# Altium schematic sheet LC_LPF12.SchDoc: PCB-LC_LPF12
size A4; Author: Ravi dusi; SheetNumber: 1; SheetTotal: 1
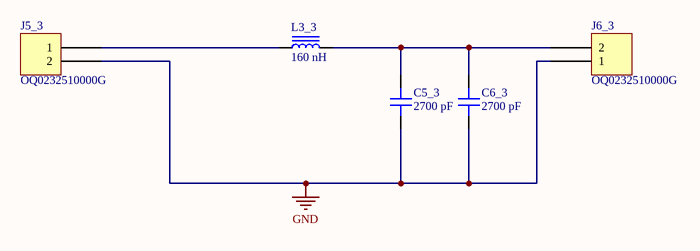
[diagram p0: LC_LPF12.SchDoc]

## Parts
C5_3  2700 pF  [CAP 0603_1608]
C6_3  2700 pF  [CAP 0603_1608]
J5_3  OQ0232510000G  [FCI 06-381-2PIN]
J6_3  OQ0232510000G  [FCI 06-381-2PIN]
L3_3  160 nH  [IND 0402_1005 RF WW]

## Nets
GND: C5_3.1 C6_3.1 J5_3.2 J6_3.1
NetC5_3_2: C5_3.2 C6_3.2 J6_3.2 L3_3.2
NetJ5_3_1: J5_3.1 L3_3.1

## Notes on the sheet
- DOCUMENT NAME:
- TITLE:
- This document is created by Mitai. Any further questions can be asked through
- AUTHOR :
- REVIEWER:
- Sheet
- PART NO.:
- of
- *
- DATE:
- TEMPLATE:
- team@mitai.ai.
- A4
- Contact Address:Rosenheimer Straße 116b,81669, München.

## Library data of the parts
C5_3 C6_3 = C0603C272F3GAC7867: CAP CER 2700PF 25V NP0 0603; manufacturer: KEMET; Temperature Coefficient: C0G, NP0; Tolerance: ±1%; Part Number: C0603C272F3GAC7867; Value: 2700 pF; Applications: General Purpose; Capacitance: 2700 pF; componentlink1description: Datasheet; componentlink1url: https://api.kemet.com/component-edge/download/datasheet/C0603C272F3GACTU.pdf; componentlink2description: DigiKey Link; componentlink2url: https://www.digikey.com/en/products/detail/kemet/C0603C272F3GAC7867/2200413; Device Package: 0603 (1608 Metric); Features: Low ESL; lastupdated: 03/09/2023 19:08:49; Lifecycle Status: Active; Minimum Order: 1; Mounting Type: Surface Mount, MLCC; Operating Temperature: -55°C ~ 125°C; Package / Case: 0603 (1608 Metric); packaging: TapeAndReel; partid: 2138; Part Status: Active; price: 0.40; series: SMD Comm C0G; Size / Dimension: 0.063" L x 0.031" W (1.60mm x 0.80mm); Supplier 1: DigiKey; Supplier Part Number 1: 399-17403-1-ND; Thickness (Max): 0.034" (0.87mm); Voltage - Rated: 25V
J5_3 J6_3 = OQ0232510000G: TERM BLOCK HDR 2POS 90DEG 3.81MM; Manufacturer: Amphenol Anytek; Current - UL: 10A; Header Orientation: 90°, Right Angle; Number of Levels: 1; Number of Positions: 2; Pitch: 0.150" (3.81mm); Voltage - UL: 300V; Part Number: OQ0232510000G; Color: Green; ComponentLink1Description: Datasheet; ComponentLink1URL: http://portal.fciconnect.com/Comergent//fci/drawing/oqxx32x100j0g.pdf; ComponentLink2Description: DigiKey Link; ComponentLink2URL: //digikey.com/product-detail/en/amphenol-anytek/OQ0232510000G/609-3819-ND/2261255; Contact Mating Finish: Tin; LastUpdated: 16/12/2019 19:14:30; Lifecycle Status: 0; Minimum Order: 1; Mounting Type: Through Hole; Operating Temperature: -40°C ~ 115°C; Packaging: Bulk; Part Status: Active; Positions Per Level: 2; Price: 0.49; Series: 06-381; Supplier 1: DigiKey; Supplier Part Number 1: 609-3819-ND; Termination Style: Solder; Type: Header, Male Pins, Shrouded (4 Side)
L3_3 = LQW15CNR16J00D: FIXED IND 160NH 480MA 330MOHM SM; Manufacturer: Murata Electronics; DC Resistance (DCR): 330mOhm Max; Frequency - Self Resonant: 900MHz; Inductance Frequency - Test: 100 MHz; Material - Core: Ferrite; Shielding: Unshielded; Tolerance: ±5%; Type: Drum Core, Wirewound; Part Number: LQW15CNR16J00D; ComponentLink1Description: Datasheet; ComponentLink1URL: https://search.murata.co.jp/Ceramy/image/img/P02/JELF243A-0087.pdf; ComponentLink2Description: DigiKey Link; ComponentLink2URL: https://www.digikey.com/en/products/detail/murata-electronics/LQW15CNR16J00D/4359664; Current Rating (Amps): 480 mA; Device Package: 0402 (1005 Metric); Height - Seated (Max): 0.024" (0.60mm); Inductance: 160 nH; LastUpdated: 03/09/2023 20:25:06; Lifecycle Status: Active; Minimum Order: 1; Mounting Type: Surface Mount; Operating Temperature: -55°C ~ 125°C; Package / Case: 0402 (1005 Metric); Packaging: TapeAndReel; PartId: 1; Part Status: Active; Price: 0.19; Series: LQW15; Size / Dimension: 0.039" L x 0.024" W (1.00mm x 0.60mm); Supplier 1: DigiKey; Supplier Part Number 1: 490-14716-1-ND; Value: 160 nH